# Altium schematic sheet Sheet1.SchDoc
size A; SheetNumber: 1; SheetTotal: 1
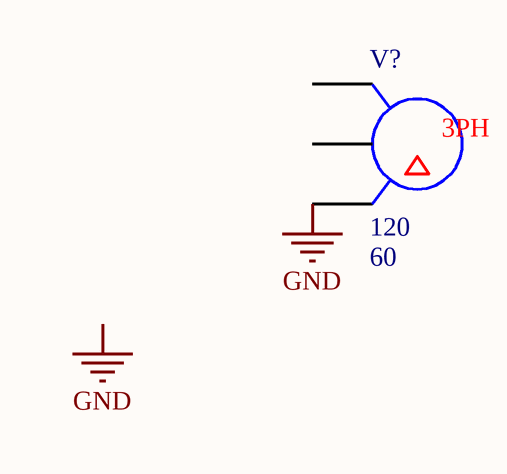
[diagram p0: Sheet1.SchDoc]

## Parts
V?  V_RMS: 120  FREQ: 60  (hidden comment: 3-Phase Delta Voltage Source)

## Nets
GND: V?.3

Not connected (* = marked no-connect by the designer): V? 1 2

## Notes on the sheet
- Labels drawn without touching a wire or pin: GND
- (in symbol 3 Phase Delta) 3PH

## Library data of the parts
V? = 3 Phase Delta: SimulationGenericComponent: True